# EAGLE design Bluetooth [RN-41] Module (EAGLE 6.3)
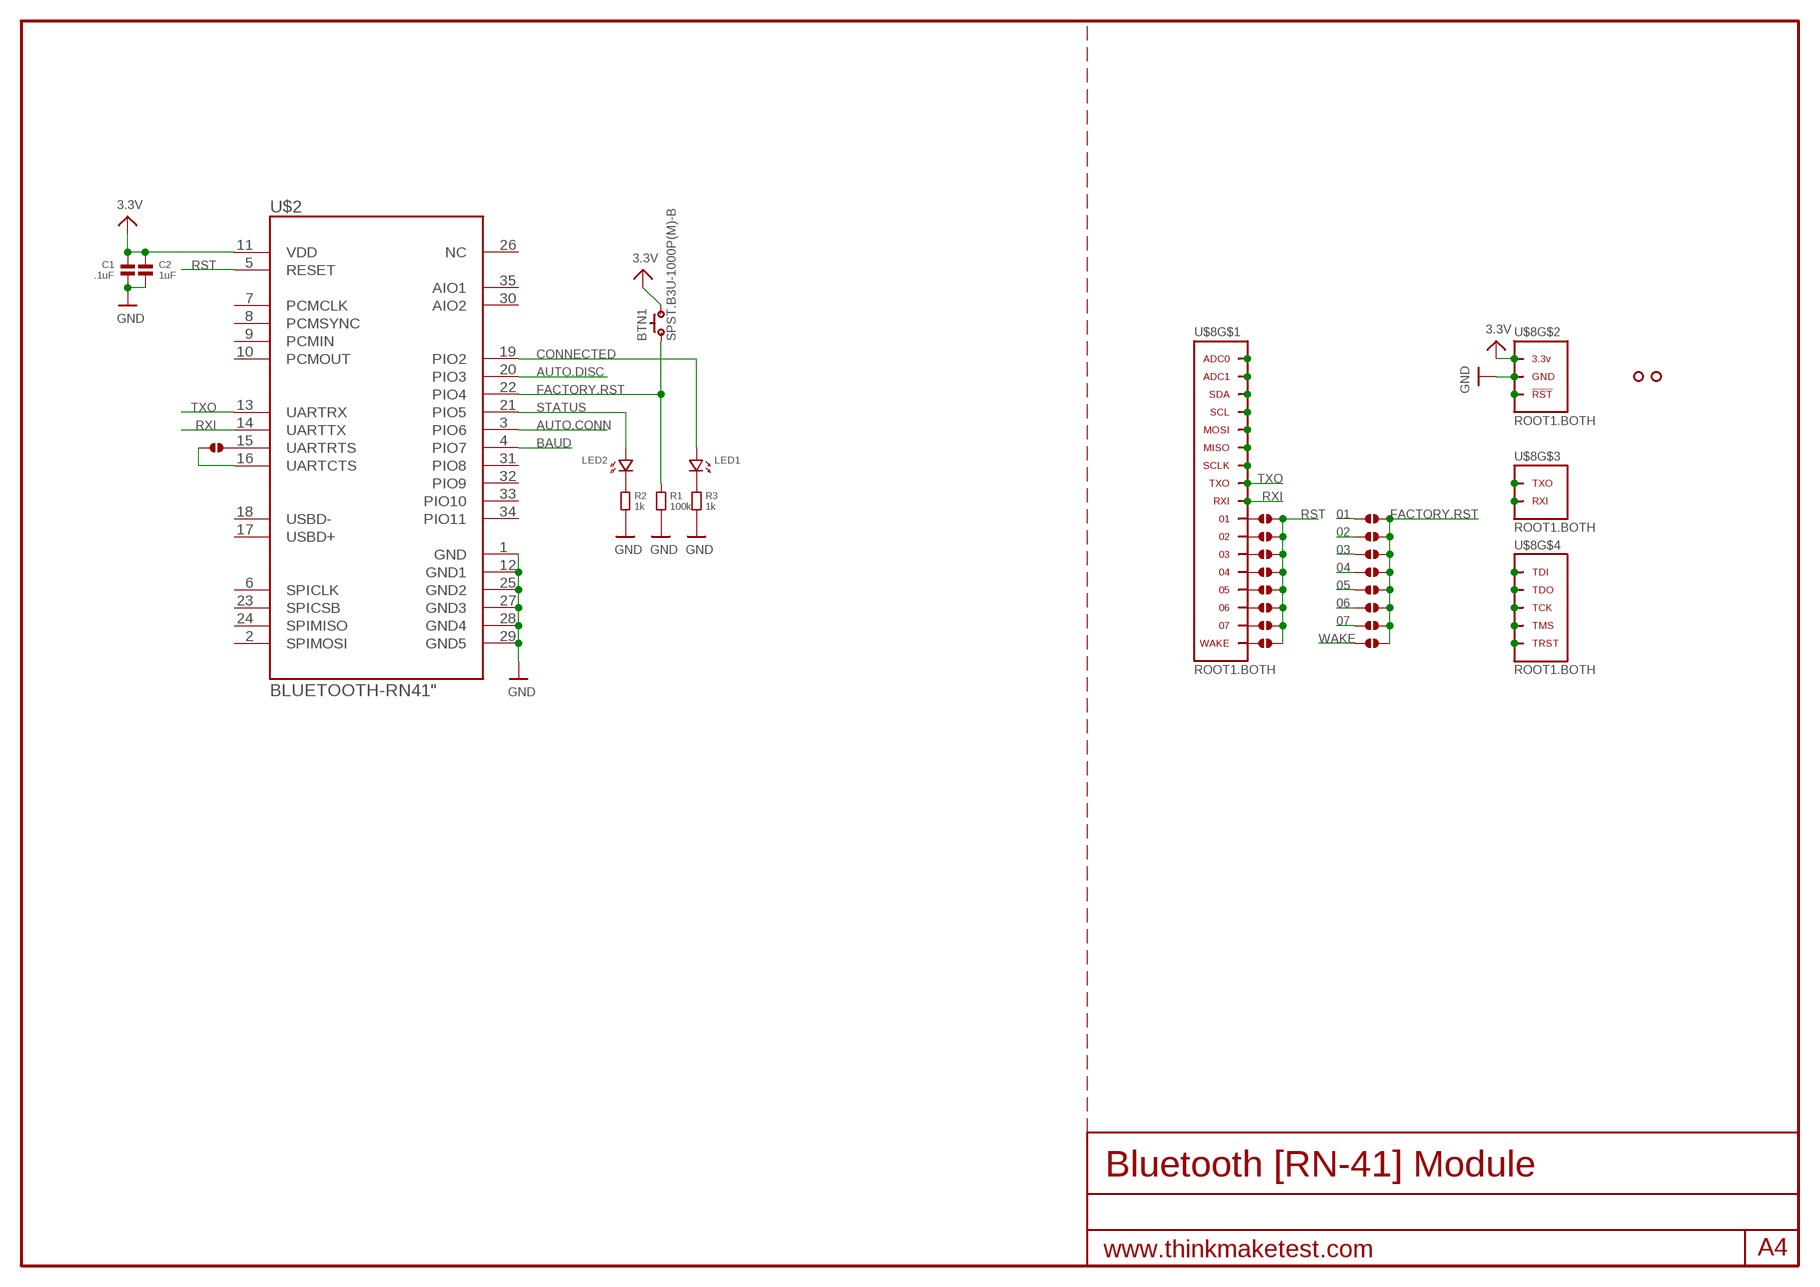
[diagram p0: schematic, sheet 1]

## Parts
01  SOLDERJUMPER.2.SML  [2.SML]
08  SOLDERJUMPER.2.SML  [2.SML]
BTN1  SPST.B3U-1000P(M)-B  [B3U-1000P(M)-B]
C1  .1uF  CAPACITOR.0603  [0603]
C2  1uF  CAPACITOR.0603  [0603]
J1  SOLDERJUMPER.2.LRG  [2.LRG]
J2  SOLDERJUMPER.2.SML  [2.SML]
J3  SOLDERJUMPER.2.SML  [2.SML]
J4  SOLDERJUMPER.2.SML  [2.SML]
J5  SOLDERJUMPER.2.SML  [2.SML]
J6  SOLDERJUMPER.2.SML  [2.SML]
J7  SOLDERJUMPER.2.SML  [2.SML]
J8  SOLDERJUMPER.2.SML  [2.SML]
J9  SOLDERJUMPER.2.SML  [2.SML]
J10  SOLDERJUMPER.2.SML  [2.SML]
J11  SOLDERJUMPER.2.SML  [2.SML]
J12  SOLDERJUMPER.2.SML  [2.SML]
J13  SOLDERJUMPER.2.SML  [2.SML]
J14  SOLDERJUMPER.2.SML  [2.SML]
J15  SOLDERJUMPER.2.SML  [2.SML]
LED1  LED.0603  [0603.LED]
LED2  LED.0603  [0603.LED]
R1  100k  RESISTOR.0603  [0603]
R2  1k  RESISTOR.0603  [0603]
R3  1k  RESISTOR.0603  [0603]
U$2  BLUETOOTH-RN41"  [RN41]
U$3  HOLE.2MM  [2MM]
U$4  HOLE.2MM  [2MM]
U$8  ROOT1.BOTH  [ROOT1.BOTH]

## Nets
01: J2.1 J4.1 U$8.01 U$8.01@1 U$8.01@VIA
02: J3.1 J10.1 U$8.02 U$8.02@1 U$8.02@VIA
03: J5.1 J11.1 U$8.03 U$8.03@1 U$8.03@VIA
3.3V: BTN1.2 C1.1 C2.1 U$2.11(VDD) U$8.3.3V@1(3.3V) U$8.3.3V@2(3.3V) U$8.3.3V@3(3.3V) U$8.3.3V@4(3.3V) U$8.3.3V@5(3.3V) U$8.3.3V@6(3.3V) U$8.3.3V@7(3.3V) U$8.3.3V@8(3.3V) U$8.3.3V@9(3.3V) U$8.3.3V@10(3.3V) U$8.3.3V@11(3.3V) U$8.3.3V@12(3.3V) U$8.3.3V@13(3.3V) U$8.3.3V@14(3.3V) U$8.3.3V@15(3.3V) U$8.3.3V@16(3.3V) U$8.3.3V@17(3.3V) U$8.3.3V@18(3.3V) U$8.3.3V@19(3.3V) U$8.3.3V@20(3.3V) U$8.3.3V@21(3.3V) U$8.3.3V@22(3.3V) U$8.3.3V@23(3.3V) U$8.3.3V@24(3.3V) U$8.3.3V@VIA(3.3V)
04: J6.1 J12.1 U$8.04 U$8.04@1 U$8.04@VIA
05: J7.1 J13.1 U$8.05 U$8.05@1 U$8.05@VIA
06: J8.1 J14.1 U$8.06 U$8.06@1 U$8.06@VIA
07: J9.1 J15.1 U$8.07 U$8.07@1 U$8.07@VIA
AUTO.CONN: U$2.3(PIO6)
AUTO.DISC: U$2.20(PIO3)
BAUD: U$2.4(PIO7)
CONNECTED: LED1.P$1 U$2.19(PIO2)
FACTORY.RST: 01.2 BTN1.1 J4.2 J10.2 J11.2 J12.2 J13.2 J14.2 J15.2 R1.1 U$2.22(PIO4)
GND: C1.2 C2.2 R1.2 R2.2 R3.2 U$2.1(GND) U$2.12(GND1) U$2.25(GND2) U$2.27(GND3) U$2.28(GND4) U$2.29(GND5) U$8.GND@1(GND) U$8.GND@2(GND) U$8.GND@3(GND) U$8.GND@4(GND) U$8.GND@5(GND) U$8.GND@6(GND) U$8.GND@7(GND) U$8.GND@8(GND) U$8.GND@9(GND) U$8.GND@10(GND) U$8.GND@11(GND) U$8.GND@12(GND) U$8.GND@13(GND) U$8.GND@14(GND) U$8.GND@15(GND) U$8.GND@16(GND) U$8.GND@17(GND) U$8.GND@18(GND) U$8.GND@19(GND) U$8.GND@20(GND) U$8.GND@21(GND) U$8.GND@22(GND) U$8.GND@23(GND) U$8.GND@24(GND) U$8.GND@25(GND) U$8.GND@26(GND) U$8.GND@VIA(GND)
N$1: U$8.ADC0 U$8.ADC0@1(ADC0) U$8.ADC0@VIA(ADC0)
N$2: U$8.ADC1 U$8.ADC1@1(ADC1) U$8.ADC1@VIA(ADC1)
N$3: U$8.SDA U$8.SDA@1(SDA) U$8.SDA@VIA(SDA)
N$4: U$8.SCL U$8.SCL@1(SCL) U$8.SCL@VIA(SCL)
N$5: U$8.MOSI U$8.MOSI@1(MOSI) U$8.MOSI@VIA(MOSI)
N$6: U$8.MISO U$8.MISO@1(MISO) U$8.MISO@VIA(MISO)
N$7: U$8.SCLK U$8.SCLK@1(SCLK) U$8.SCLK@VIA(SCLK)
N$8: J1.2 U$2.15(UARTRTS)
N$9: J1.1 U$2.16(UARTCTS)
N$10: LED2.P$2 R2.1
N$11: U$8.TRST U$8.TRST@1(TRST) U$8.TRST@VIA(TRST)
N$12: U$8.TMS U$8.TMS@1(TMS) U$8.TMS@VIA(TMS)
N$13: U$8.TCK U$8.TCK@1(TCK) U$8.TCK@VIA(TCK)
N$14: U$8.TDO U$8.TDO@1(TDO) U$8.TDO@VIA(TDO)
N$15: U$8.TDI U$8.TDI@1(TDI) U$8.TDI@VIA(TDI)
N$16: U$8.RXI.DBG(RXI) U$8.RXI.DBG@1(RXI) U$8.RXI.DBG@VIA(RXI)
N$17: U$8.TXO.DBG(TXO) U$8.TXO.DBG@1(TXO) U$8.TXO.DBG@VIA(TXO)
N$19: U$8.RST(!RST) U$8.RST@1(!RST) U$8.RST@VIA(!RST)
N$23: LED1.P$2 R3.1
RST: 08.2 J2.2 J3.2 J5.2 J6.2 J7.2 J8.2 J9.2 U$2.5(RESET)
RXI: U$2.14(UARTTX) U$8.RXI U$8.RXI@1(RXI) U$8.RXI@VIA(RXI)
STATUS: LED2.P$1 U$2.21(PIO5)
TXO: U$2.13(UARTRX) U$8.TXO U$8.TXO@1(TXO) U$8.TXO@VIA(TXO)
WAKE: 01.1 08.1 U$8.WAKE U$8.WAKE@1(WAKE) U$8.WAKE@VIA(WAKE)
Unconnected: U$2.2(SPIMOSI) U$2.6(SPICLK) U$2.7(PCMCLK) U$2.8(PCMSYNC) U$2.9(PCMIN) U$2.10(PCMOUT) U$2.17(USBD+) U$2.18(USBD-) U$2.23(SPICSB) U$2.24(SPIMISO) U$2.26(NC) U$2.30(AIO2) U$2.31(PIO8) U$2.32(PIO9) U$2.33(PIO10) U$2.34(PIO11) U$2.35(AIO1)

## Library data of the parts
01 08 J1-J15 = .solderjumper:SOLDERJUMPER.2
BTN1 = omron:SPST
C1 C2 = .standardparts:CAPACITOR
LED1 LED2 = .standardparts:LED
R1-R3 = .standardparts:RESISTOR
U$2 = SparkFun:BLUETOOTH-RN41
U$3 U$4 = .screw_holes:HOLE
U$8 = thinkmaketest:ROOT1

## Board
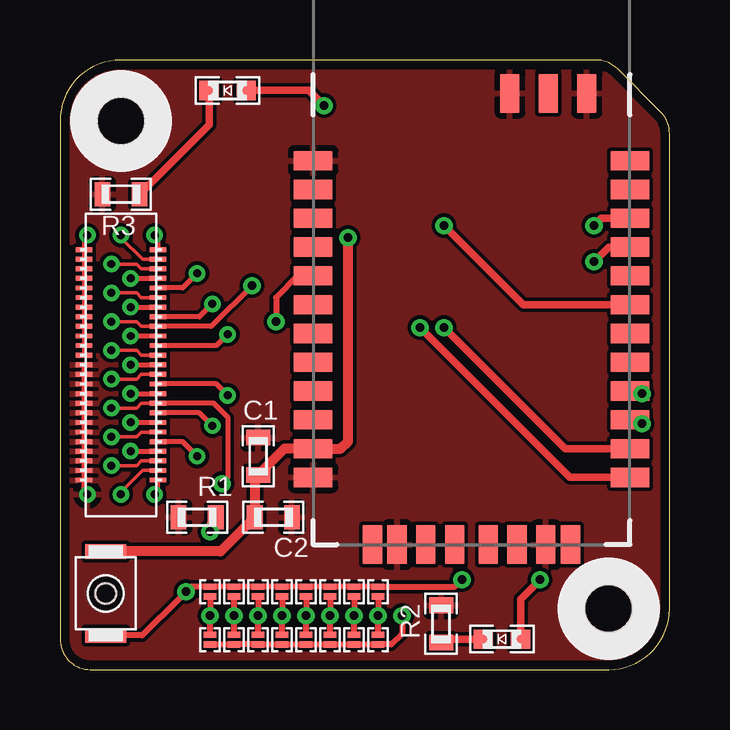
[diagram p1: board, top side]
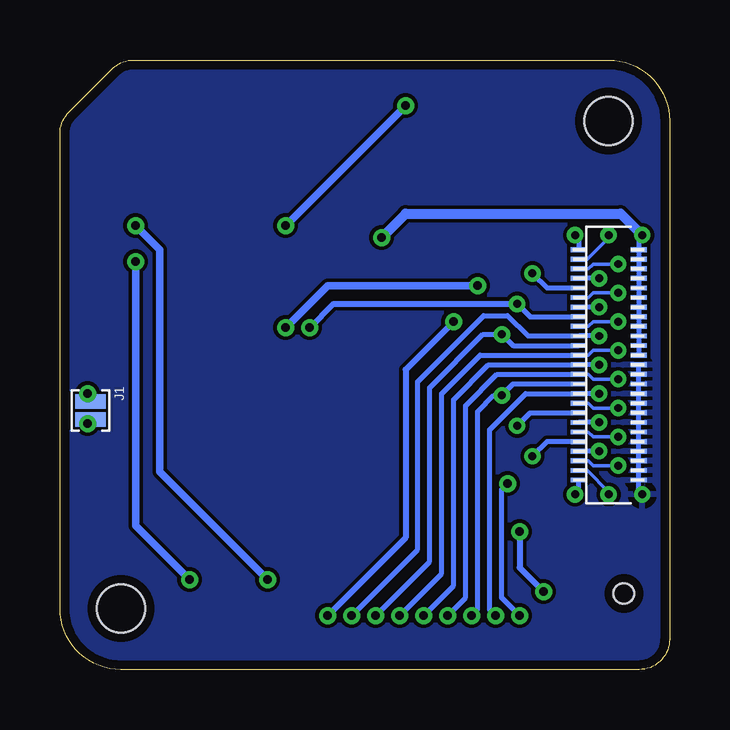
[diagram p2: board, bottom side, seen from below]

Size 25.4 x 25.4 mm. Coordinates in mm from the lower left corner, seen from the top.
Outline: 0,22.86 0,1.27 arc90 1.27,0 22.86,0 arc90 25.4,2.54 25.4,22.33 arc45 25.03,23.23 23.23,25.03 arc45 22.33,25.4 2.54,25.4 arc90 0,22.86
Copper layers (1*16): Top 0.0356mm / dielectric 1.5011mm / Bottom 0.0356mm
Design rules "default": minimum track width 6mil, minimum drill 13mil, track to track 6mil, track to pad 6mil, pad to pad 6mil, via to via 6mil, smd to smd 6mil, copper to edge 15mil, drill to drill 6mil, minimum pad ring 7mil, minimum via ring 7mil, stop-mask expansion 4mil, vias tented up to drill 16mil, thermal gap 10mil

### Footprints (pad centres in the part's own frame; a part is rotated, then mirrored left to right if it is on the bottom)
2.SML = smd 0.254 x 0.508: 1 -0.203,0; 2 0.203,0
B3U-1000P(M)-B = smd 0.6 x 1.7: 1 -1.75,0; 2 1.75,0 | hole 0.85: 0,0
0603 = smd 0.65 x 1: 1 -0.775,0; 2 0.775,0
2.LRG = smd 0.61 x 1.27: 1 -0.381,0; 2 0.381,0
0603.LED = smd 0.8 x 0.8: P$1 -0.775,0; P$2 0.775,0
RN41 = smd 0.8 x 1.6: 1 -6.6,-6.6; 2 -5.4,-6.6; 3 -4.2,-6.6; 4 -3,-6.6; 5 -1.8,-6.6; 6 -0.6,-6.6; 7 0.6,-6.6; 8 1.8,-6.6; 9 3,-6.6; 10 4.2,-6.6; 11 5.4,-6.6; 12 6.6,-6.6; 13 6.6,6.6; 14 5.4,6.6; 15 4.2,6.6; 16 3,6.6; 17 1.8,6.6; 18 0.6,6.6; 19 -0.6,6.6; 20 -1.8,6.6; 21 -3,6.6; 22 -4.2,6.6; 23 -5.4,6.6; 24 -6.6,6.6 | smd 1.6 x 0.8: 25 -9.4,4.8; 26 -9.4,3.2; 27 -9.4,1.6; 28 9.4,3.1; 29 9.4,-3.1; 30 9.4,-4.122; 31 9.4,-1.9; 32 9.4,-0.7; 33 9.4,0.7; 34 9.4,1.9; 35 9.4,4.122
2MM = hole 2: 0,0
ROOT1.BOTH = smd 0.66 x 0.2 bottom: 01 3.795,13.9; 02 3.795,13.5; 03 3.795,13.1; 3.3V@1 1.285,17.5; 3.3V@2 1.285,17.1; 3.3V@3 1.285,16.7; 3.3V@4 1.285,16.3; 3.3V@5 1.285,15.9; 3.3V@6 1.285,15.5; 3.3V@7 1.285,15.1; 3.3V@8 1.285,14.7; 3.3V@9 1.285,14.3; 3.3V@10 1.285,13.9; 3.3V@11 1.285,13.5; 3.3V@12 1.285,13.1; 04 3.795,12.7; 05 3.795,12.3; 06 3.795,11.9; 07 3.795,11.5; ADC0 3.795,17.5; ADC1 3.795,17.1; GND@1 1.285,7.9; GND@2 1.285,8.3; GND@3 1.285,8.7; GND@4 1.285,9.1; GND@5 1.285,9.5; GND@6 1.285,9.9; GND@7 1.285,10.3; GND@8 1.285,10.7; GND@9 1.285,11.1; GND@10 1.285,11.5; GND@11 1.285,11.9; GND@12 1.285,12.3; GND@13 1.285,12.7; MISO 3.795,15.5; MOSI 3.795,15.9; RST 3.795,7.9; RXI 3.795,14.3; RXI.DBG 3.795,10.3; SCL 3.795,16.3; SCLK 3.795,15.1; SDA 3.795,16.7; TCK 3.795,9.1; TDI 3.795,9.9; TDO 3.795,9.5; TMS 3.795,8.7; TRST 3.795,8.3; TXO 3.795,14.7; TXO.DBG 3.795,10.7; WAKE 3.795,11.1 | smd 0.7 x 0.2: 01@1 4.08,13.9; 02@1 4.08,13.5; 3.3V@13 1,17.5; 3.3V@14 1,17.1; 3.3V@15 1,16.7; 3.3V@16 1,16.3; 3.3V@17 1,15.9; 3.3V@18 1,15.5; 3.3V@19 1,15.1; 3.3V@20 1,14.7; 3.3V@21 1,14.3; 3.3V@22 1,13.9; 3.3V@23 1,13.5; 3.3V@24 1,13.1; 03@1 4.08,13.1; 04@1 4.08,12.7; 05@1 4.08,12.3; 06@1 4.08,11.9; 07@1 4.08,11.5; ADC0@1 4.08,17.5; ADC1@1 4.08,17.1; GND@14 1,7.9; GND@15 1,8.3; GND@16 1,8.7; GND@17 1,9.1; GND@18 1,9.5; GND@19 1,9.9; GND@20 1,10.3; GND@21 1,10.7; GND@22 1,11.1; GND@23 1,11.5; GND@24 1,11.9; GND@25 1,12.3; GND@26 1,12.7; MISO@1 4.08,15.5; MOSI@1 4.08,15.9; RST@1 4.08,7.9; RXI.DBG@1 4.08,10.3; RXI@1 4.08,14.3; SCL@1 4.08,16.3; SCLK@1 4.08,15.1; SDA@1 4.08,16.7; TCK@1 4.08,9.1; TDI@1 4.08,9.9; TDO@1 4.08,9.5; TMS@1 4.08,8.7; TRST@1 4.08,8.3; TXO.DBG@1 4.08,10.7; TXO@1 4.08,14.7; WAKE@1 4.08,11.1 | drill 0.33 pad 0.686: 01@VIA 2.94,13.9; 02@VIA 6.985,13.97; 3.3V@VIA 1.14,18.1; 03@VIA 2.14,13.3; 04@VIA 2.94,12.7; 05@VIA 2.14,12.1; 06@VIA 6.985,11.43; 07@VIA 2.94,11.5; ADC0@VIA 3.94,18.1; ADC1@VIA 2.54,18.1; GND@VIA 1.14,7.3; MISO@VIA 2.14,15.7; MOSI@VIA 5.715,16.51; RST@VIA 3.94,7.3; RXI.DBG@VIA 2.94,10.3; RXI@VIA 2.14,14.5; SCL@VIA 2.94,16.3; SCLK@VIA 2.94,15.1; SDA@VIA 2.14,16.9; TCK@VIA 2.94,9.1; TDI@VIA 2.14,9.7; TDO@VIA 5.715,8.89; TMS@VIA 2.14,8.5; TRST@VIA 2.54,7.3; TXO.DBG@VIA 6.35,10.16; TXO@VIA 6.35,15.24; WAKE@VIA 2.14,10.9

### Placement (x,y rotation side)
01  6.25,3.25 90 top
08  6.25,1.25 270 top
BTN1  1.91,3.17 90 top
C1  8.26,8.89 90 top
C2  8.89,6.35 0 top
J1  24.13,10.79 270 bottom
J2  13.25,1.25 270 top
J3  12.25,1.25 270 top
J4  13.25,3.25 90 top
J5  11.25,1.25 270 top
J6  10.25,1.25 270 top
J7  9.25,1.25 270 top
J8  8.25,1.25 270 top
J9  7.25,1.25 270 top
J10  12.25,3.25 90 top
J11  11.25,3.25 90 top
J12  10.25,3.25 90 top
J13  9.25,3.25 90 top
J14  8.25,3.25 90 top
J15  7.25,3.25 90 top
LED1  6.99,24.13 180 top
LED2  18.41,1.27 180 top
R1  5.71,6.35 180 top
R2  15.88,1.91 90 top
R3  2.54,19.81 180 top
U$2  17.14,14.61 270 top
U$3  22.86,2.54 90 top
U$4  2.54,22.86 90 top
U$8  0,0 0 top

### Tracks (layer width: path | path; a pad name or v marks a point on that pad's centre or on a via)
01  (via drill 0.36)
  Top 0.254: J2.1 v13.25,2.25 J4.1
  Bottom 0.203: v13.25,2.25 10.5,5 10.5,12 7.75,14.75 6.75,14.75 5.9,13.9 U$8.01
02  (via drill 0.36)
  Top 0.254: J3.1 v12.25,2.25 J10.1
  Bottom 0.203: v12.25,2.25 10,4.5 10,11.75 7.78,13.97 U$8.02@VIA
03  (via drill 0.36)
  Top 0.254: J5.1 v11.25,2.25 J11.1
  Bottom 0.203: v11.25,2.25 9.5,4 9.5,11.5 7.9,13.1 U$8.03
3.3V  (via drill 0.36)
  Top 0.406: BTN1.2 6.69,4.92 C2.1 8.12,7.97 C1.1 9.35,9.21 U$2.11 11.71,9.21 12,9.5 v12,18
  Bottom 0.406: v12,18 11,19 2.04,19 U$8.3.3V@VIA
04  (via drill 0.36)
  Top 0.254: J6.1 v10.25,2.25 J12.1
  Bottom 0.203: v10.25,2.25 9,3.5 9,11.25 7.55,12.7 U$8.04
05  (via drill 0.36)
  Top 0.254: J7.1 v9.25,2.25 J13.1
  Bottom 0.203: v9.25,2.25 8.5,3 8.5,11 7.2,12.3 U$8.05
06  (via drill 0.36)
  Top 0.254: J8.1 v8.25,2.25 J14.1
  Bottom 0.203: v8.25,2.25 8,2.5 8,10.75 7.32,11.43 U$8.06@VIA
07  (via drill 0.36)
  Top 0.254: J9.1 v7.25,2.25 J15.1
  Bottom 0.203: v7.25,2.25 7.5,2.5 7.5,10 6,11.5 U$8.07
CONNECTED  (via drill 0.36)
  Top 0.305: U$2.19 19.3,15.21 v16,18.5 | v11,23.5 10.37,24.13 LED1.P$1
  Bottom 0.305: v16,18.5 v11,23.5
FACTORY.RST  (via drill 0.36)
  Top 0.254: BTN1.1 3.42,1.43 5,3 v5.25,3.25 5.45,3.45 01.2 J15.2 J14.2 J13.2 J12.2 J11.2 J10.2 J4.2 16.45,3.45 v16.75,3.75 | R1.1 6.25,6.11 v6.25,5.75
  Top 0.305: v22.25,18.5 22.55,18.8 U$2.22
  Bottom 0.254: v6.25,5.75 6.25,4.25 v5.25,3.25
  Bottom 0.305: v16.75,3.75 21.25,8.25 21.25,17.5 v22.25,18.5
GND
  pour Bottom: 0,0 25.4,0 25.4,25.4 0,25.4
  pour Top: 0,0 25.4,0 25.4,25.4 0,25.4
N$8  (via drill 0.36)
  Top 0.203: U$2.15 23.9,10.25 v24.25,10.25
  Bottom 0.203: v24.25,10.25 24.13,10.37 J1.2
N$9  (via drill 0.36)
  Top 0.203: U$2.16 24.14,11.61 v24.25,11.5
  Bottom 0.203: v24.25,11.5 24.13,11.38 J1.1
N$10
  Top 0.305: LED2.P$2 16.02,1.27 R2.1
N$23
  Top 0.305: LED1.P$2 6.21,22.71 R3.1
RST  (via drill 0.36)
  Top 0.254: 08.2 J9.2 J8.2 J7.2 J6.2 J5.2 J3.2 J2.2 13.8,1.05 14.25,1.5 v14.25,2.25 | U$2.5 9.9,16.41 9,15.5 v9,14.5
  Bottom 0.254: v9,14.5 11,12.5 11,5.5 v14.25,2.25
RXI  (via drill 0.36)
  Top 0.203: v8,16 6.3,14.3 U$8.RXI@1
  Top 0.305: U$2.14 21.05,9.21 v16,14.25
  Bottom 0.305: v16,14.25 14.25,16 v8,16
STATUS  (via drill 0.36)
  Top 0.305: v22.25,17 22.86,17.61 U$2.21 | v20,3.75 19.19,2.94 LED2.P$1
  Bottom 0.305: v20,3.75 22.25,6 v22.25,17
TXO  (via drill 0.36)
  Top 0.305: U$2.13 21.25,8.01 v15,14.25
  Bottom 0.254: v15,14.25 14.01,15.24 U$8.TXO@VIA
WAKE  (via drill 0.36)
  Top 0.203: v6.75,7.75 7,8 7,10.5 6.4,11.1 U$8.WAKE@1
  Top 0.254: 08.1 v6.25,2.25 01.1
  Bottom 0.203: v6.25,2.25 7,3 7,7.5 v6.75,7.75

### Text on the board
tDocu: CONN | Factory | RST | STAT | RST
bDocu: CTS | RTS | Cruz Monrreal II | v1 | InnovativeMaker.com